# Altium schematic sheet EPS_Power.SchDoc
size A4; SheetNumber: 3; SheetTotal: 4
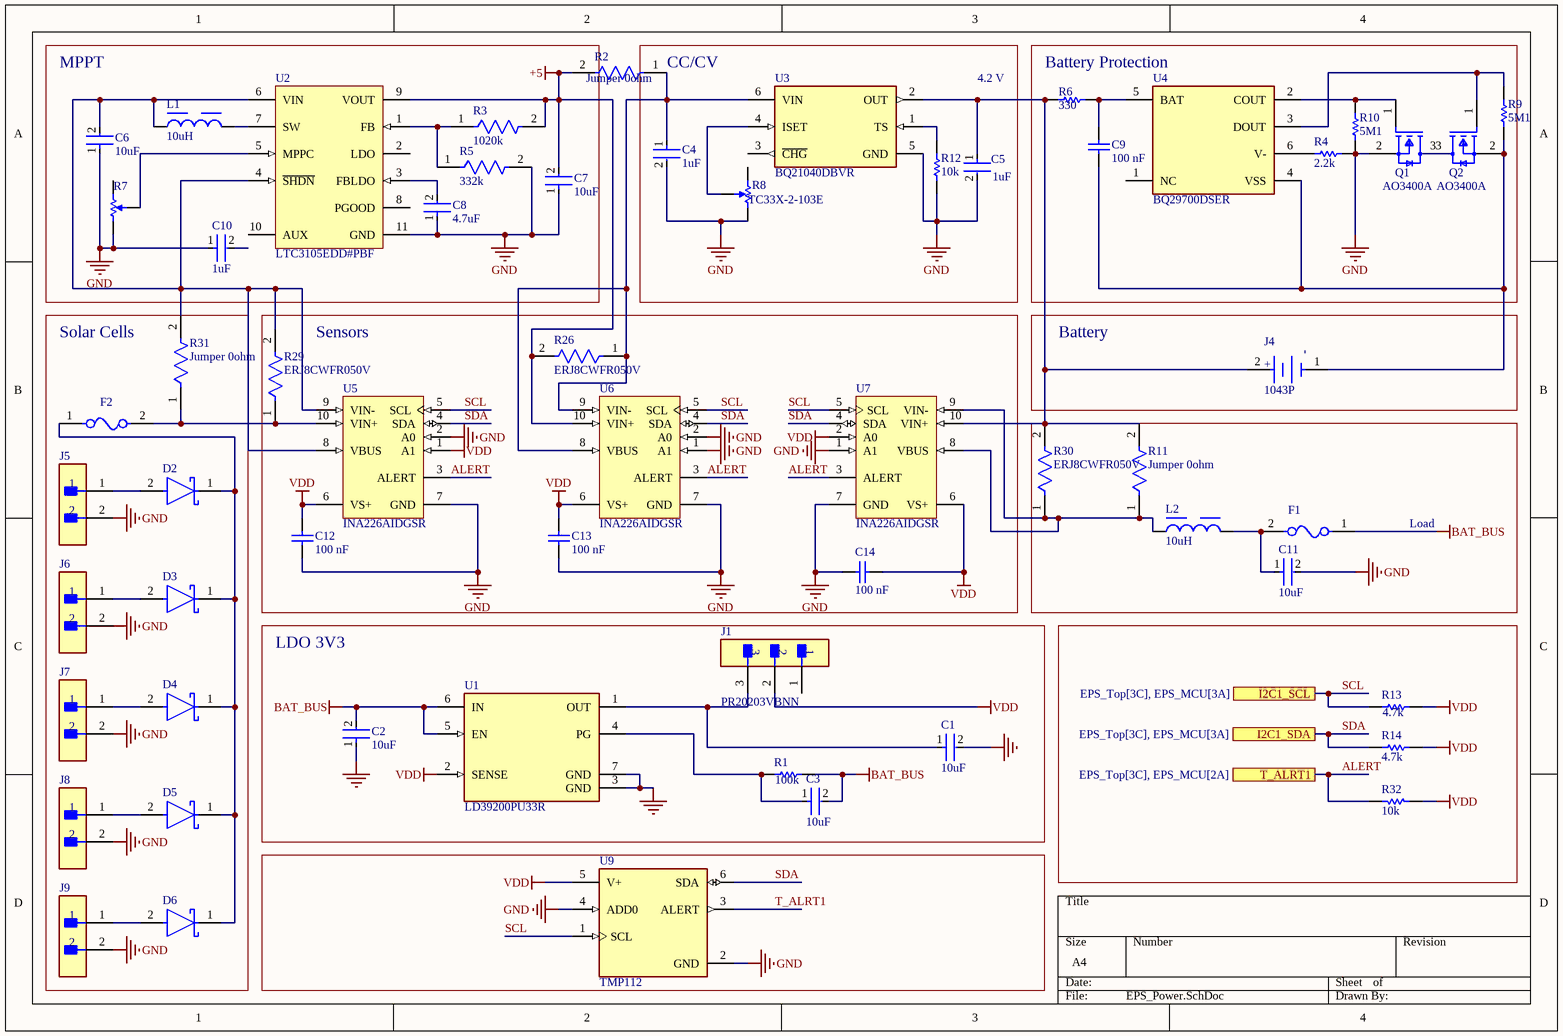
[diagram p0: EPS_Power.SchDoc]

## Parts
C1  10uF  [FP-CL21B106KOQNNNG-MFG]
C2  10uF  [FP-CL21B106KOQNNNG-MFG]
C3  10uF  [FP-CL21B106KOQNNNG-MFG]
C4  1uF  [FP-CL10-IPC_C]
C5  1uF  [FP-CL10-IPC_C]
C6  10uF  [FP-CL21B106KOQNNNG-MFG]
C7  10uF  [FP-CL21B106KOQNNNG-MFG]
C8  4.7uF  [FP-CC0805-0_85-MFG]
C9  100 nF  [CAPC1050X55X23ML05T13]
C10  1uF  [FP-CL10-IPC_A]
C11  10uF  [FP-CL21B106KOQNNNG-MFG]
C12  100 nF  [CAPC1050X55X23ML05T13]
C13  100 nF  [CAPC1050X55X23ML05T13]
C14  100 nF  [CAPC1050X55X23ML05T13]
D2  BAT60AE6327HTSA1  [FP-PG-SOD323-2-IPC_C]  (value not drawn)
D3  BAT60AE6327HTSA1  [FP-PG-SOD323-2-IPC_C]  (value not drawn)
D4  BAT60AE6327HTSA1  [FP-PG-SOD323-2-IPC_C]  (value not drawn)
D5  BAT60AE6327HTSA1  [FP-PG-SOD323-2-IPC_C]  (value not drawn)
D6  BAT60AE6327HTSA1  [FP-PG-SOD323-2-IPC_C]  (value not drawn)
F1  MF-NSMF020-2  [FP-MF-NSMF020-2-MFG]  (value not drawn)
F2  MF-NSMF020-2  [FP-MF-NSMF020-2-MFG]  (value not drawn)
J1  PR20203VBNN  [FP-PR20203VBNN-MFG]
J4  1043P  [FP-1043P-MFG]
J5  B2B-XH-A(LF)(SN)  [FP-B2B-XH-A_LF_SN-MFG]  (value not drawn)
J6  B2B-XH-A(LF)(SN)  [FP-B2B-XH-A_LF_SN-MFG]  (value not drawn)
J7  B2B-XH-A(LF)(SN)  [FP-B2B-XH-A_LF_SN-MFG]  (value not drawn)
J8  B2B-XH-A(LF)(SN)  [FP-B2B-XH-A_LF_SN-MFG]  (value not drawn)
J9  B2B-XH-A(LF)(SN)  [FP-B2B-XH-A_LF_SN-MFG]  (value not drawn)
L1  10uH  [WE-LHMI_4020]
L2  10uH  [WE-LHMI_4020]
Q1  AO3400A  [FP-SOT23-MFG]
Q2  AO3400A  [FP-SOT23-MFG]
R1  100k  [RESC1005X40X25NL05T10]
R2  Jumper 0ohm  [FP-RC1206-MFG]
R3  1020k  [FP-CRCW0603-e3-IPC_A]
R4  2.2k  [RESC1608X55X25LL10T15]
R5  332k  [FP-CRCW0603-e3-IPC_A]
R6  330  [RESC1608X55X30LL15T15]
R7  TC33X-2-103E  [BOUR-TC33X-2_V]  (value not drawn)
R8  TC33X-2-103E  [BOUR-TC33X-2_V]
R9  5M1  [RESC1609X50X30NL10T20]
R10  5M1  [RESC1609X50X30NL10T20]
R11  Jumper 0ohm  [FP-RC1206-MFG]
R12  10k  [RESC1005X40X25LL05T10]
R13  4.7k  [RESC1005X40X25LL05T05]
R14  4.7k  [RESC1005X40X25LL05T05]
R26  ERJ8CWFR050V  [FP-ERJ8CW-IPC_B]
R29  ERJ8CWFR050V  [FP-ERJ8CW-IPC_B]
R30  ERJ8CWFR050V  [FP-ERJ8CW-IPC_B]
R31  Jumper 0ohm  [FP-RC1206-MFG]
R32  10k  [RESC1005X40X25LL05T05]
U1  LD39200PU33R  [FP-DFN6-7946637-MFG]
U2  LTC3105EDD#PBF  [LT-DD-10_V]
U3  BQ21040DBVR  [FP-DBV0006A-MFG]
U4  BQ29700DSER  [FP-DSE0006A-IPC_B]
U5  INA226AIDGSR  [DGS0010A_L]
U6  INA226AIDGSR  [DGS0010A_L]
U7  INA226AIDGSR  [DGS0010A_L]
U9  TMP112  [FP-DRL0006A-MFG]

## Blocks framed on the sheet
MPPT: C6-C8 C10 L1 R3 R5 R7 U2
CC/CV: C4 C5 R8 R12 U3
Battery Protection: C9 Q1 Q2 R4 R6 R9 R10 U4
Solar Cells: D2-D6 F2 J5-J9 R31
Sensors: C12-C14 R26 R29 U5-U7
Battery: J4
Load: C11 F1 L2 R11 R30
LDO 3V3: C1-C3 J1 R1 U1

## Ports
I2C1_SCL (see EPS_Top[3C], EPS_MCU[3A]), I2C1_SDA (see EPS_Top[3C], EPS_MCU[3A]), T_ALRT1 (see EPS_Top[3C], EPS_MCU[2A])

## Nets
+5: C7.2 R2.2 R3.2 R26.2 U2.9(VOUT) U6.10(VIN+)
BAT_BUS: C2.2 C3.2 F1.1 R1.2 U1.5(EN) U1.6(IN)
GND: C1.2 C2.1 C4.2 C5.2 C6.1 C7.1 C8.1 C10.1 C11.2 C12.1 C13.1 C14.1 J5.2 J6.2 J7.2 J8.2 J9.2 Q1.2(S) R4.2 R5.2 R7.1 R8.3 R10.1 R12.2 U1.3(GND) U1.7(GND) U2.11(GND) U3.5(GND) U5.2(A0) U5.7(GND) U6.1(A1) U6.2(A0) U6.7(GND) U7.1(A1) U7.7(GND) U9.2(GND) U9.4(ADD0)
VDD: C12.2 C13.2 C14.2 J1.2 R13.2 R14.2 R32.1 U1.2(SENSE) U5.1(A1) U5.6(VS+) U6.6(VS+) U7.2(A0) U7.6(VS+) U9.5(V+)
ALERT: R32.2 U5.3(ALERT) U6.3(ALERT) U7.3(ALERT) ; port T_ALRT1
SCL: R13.1 U5.5(SCL) U6.5(SCL) U7.5(SCL) U9.1(SCL) ; port I2C1_SCL
SDA: R14.1 U5.4(SDA) U6.4(SDA) U7.4(SDA) U9.6(SDA) ; port I2C1_SDA
T_ALRT1: U9.3(ALERT)
NetC1_1: C1.1 J1.3 U1.1(OUT)
NetC3_1: C3.1 R1.1 U1.4(PG)
NetC4_1: C4.1 R2.1 R26.1 U3.6(VIN) U6.8(VBUS) U6.9(VIN-)
NetC5_1: C5.1 J4.2(A) R6.2 R11.2 R30.2 U3.2(OUT) U7.10(VIN+)
NetC6_2: C6.2 L1.1 R29.2 R31.2 U2.4(~{SHDN}) U2.6(VIN) U5.8(VBUS) U5.9(VIN-)
NetC8_2: C8.2 U2.3(FBLDO)
NetC9_1: C9.1 R6.1 U4.5(BAT)
NetC9_2: C9.2 J4.1(C) Q2.2(S) R9.1 U4.4(VSS)
NetC11_1: C11.1 F1.2 L2.2
NetD2_1: D2.1(C) D3.1(C) D4.1(C) D5.1(C) D6.1(C) F2.1
NetD2_2: D2.2(A) J5.1
NetD3_2: D3.2(A) J6.1
NetD4_2: D4.2(A) J7.1
NetD5_2: D5.2(A) J8.1
NetD6_2: D6.2(A) J9.1
NetF2_2: F2.2 R29.1 R31.1 U5.10(VIN+)
NetL1_2: L1.2 U2.7(SW)
NetL2_1: L2.1 R11.1 R30.1 U7.8(VBUS) U7.9(VIN-)
NetQ1_1: Q1.1(G) R10.2 U4.2(COUT)
NetQ1_3: Q1.3(D) Q2.3(D)
NetQ2_1: Q2.1(G) R9.2 U4.3(DOUT)
NetR3_1: R3.1 R5.1 U2.1(FB)
NetR4_1: R4.1 U4.6(V-)
NetR7_2: R7.2 U2.5(MPPC)
NetR8_2: R8.2 U3.4(ISET)
NetR12_1: R12.1 U3.1(TS)

Not connected (* = marked no-connect by the designer): C10 2; J1 1; R7 3; R8 1; U2 2(LDO) 8(PGOOD) 10(AUX); U3 3(~{CHG}); U4 1(NC)

## Notes on the sheet
- 4.2 V
- (near J1) +3V3
- (in symbol CMP-19636-000034-1) +

## Library data of the parts
C1-C3 C6 C7 C11 = CMP-13271-000015-1: CAP CER 10UF 16V X7R 0805; Manufacturer Part Number: CL21B106KOQNNNG; Manufacturer: Samsung Electro-Mechanics; Temperature Coefficient: 15%; Tolerance: 10%; Material: Ceramic; ComponentLink2URL: http://product.samsungsem.com/mlcc/CL21B106KOQNNN.do; Package: 0; Voltage Rating: 16V; Value: 10uF; Height: 1.4mm; Temperature Characteristic: X7R; Category: Cap; Lead Free: Yes; RoHS: TRUE; ComponentLink2Description: Datasheet; Octopart: https://octopart.com/cl21b106koqnnng-samsung-19995691; Device Class L1: Passive Components; Temperature Range Low: -55°C; Device Class L3: Ceramic Capacitors; Ipc Land Pattern Name: CAPC200125X125; Digikey Description: CAP CER 10UF 16V X7R 0805; Automotive: No; Capacitance: 10uF; Temperature Range High: +125°C; Device Class L2: Capacitors; Temperature: -55°C to +125°C
C4 C5 = CMP-13271-004127-1: Cap Ceramic 1uF 25V X5R ±10% Pad SMD 0603 +85°C T/R; Height: 0.8mm; Capacitance: 1uF; Depth: 0.8mm; Package Quantity: 1; Mount: Surface Mount; Contact Plating: Tin; Voltage Rating: 25V; Dielectric: X5R; Packaging: Tape and Reel; Material: Ceramic; Case Code (Metric): 1608; Length: 1.6mm; Voltage: 25V; Min Operating Temperature: -55°C; Width: 0.031inch; Tolerance: 10%; Case/Package: 0603; Radiation Hardening: No; Case Code (Imperial): 0603; Thickness: 0.035inch; Lead Free: Lead Free; Max Operating Temperature: 85°C; Voltage Rating (DC): 25V
C8 = CMP-03422-000207-1: CAP CER 4.7UF 16V X7R 0805; Manufacturer: Yageo; Manufacturer Part Number: CC0805KKX7R7BB475; Tolerance: 0.1; Material: Ceramic; Footprint Url: http://www.yageo.com/exep/pages/download/literatures/UPY-C_GEN_24.pdf; Device Class L3: Ceramic Capacitors; Temperature: -30°C to +85°C; Device Class L2: Capacitors; Automotive: No; Digikey Description: CAP CER 4.7UF 16V X7R 0805; Temperature Range High: +85°C; Lead Free: Yes; Mouser Description: Multilayer Ceramic Capacitors MLCC - SMD/SMT 4.7M pF 10% 16 Volts; Temperature Characteristic: X7R; Height: 0.95mm; Device Class L1: Passive Components; ComponentLink2Description: Datasheet; Category: Cap; Octopart: https://octopart.com/cc0805kkx7r7bb475-yageo-34429188; Temperature Range Low: -30°C; Package: CC0805-0.85; Ipc Land Pattern Name: CAPC200125X85; RoHS: TRUE; Value: 4.7 uF; Capacitance: 4.7 uF; ComponentLink2URL: http://www.yageo.com/documents/recent/UPY-GPHC_Y5V_6.3V-to-50V_8.pdf; Voltage Rating: 16 V
C9 C12-C14 = CMP-2000-05439-1: Chip Capacitor, 100 nF, +/- 10%, 16 V, -55 to 125 degC, 0402 (1005 Metric), RoHS, Tape and Reel; Manufacturer: Samsung Electro-Mechanics; Capacitance: 100000pF; Dielectric: X7R; Rated Voltage: 16V; Case Size/Dimension: 0402; Tolerance (%): ±10%; Manufacturer URL: http://www.samsungsem.com/global/index.jsp; Datasheet URL: https://datasheet.ciiva.com/29198/458718-da-01-en-vs-kondensator-0402-29198423.pdf; Datasheet Version: Nov-10
C10 = CMP-13271-001457-1: Cap Ceramic 1uF 16V X5R ±10% Pad SMD 0603 +85°C T/R; Dielectric: X5R; Height: 0.8mm; Capacitance: 1uF; Mount: Surface Mount; Thickness: 0.035inch; Width: 0.031inch; Min Operating Temperature: -55°C; Contact Plating: Tin; Case Code (Imperial): 0603; Depth: 0.8mm; Length: 1.6mm; Max Operating Temperature: 85°C; Packaging: Tape and Reel; Tolerance: 10%; Radiation Hardening: No; Case/Package: 0603; Package Quantity: 1; Voltage Rating: 16V; Case Code (Metric): 1608; Voltage: 16V; Material: Ceramic; Lead Free: Lead Free; Voltage Rating (DC): 16V
D2-D6 = CMP-32890-000004-1: DIODE SCHOTTKY 10V 3A SOD323-2; Forward Voltage: 370mV; Polarity: Standard; Peak Non-Repetitive Surge Current: 5A; Element Configuration: Single; Max Operating Temperature: 85°C; Current Rating: 3A; Number of Pins: 2; Mount: Surface Mount; Forward Current: 3A; Max Reverse Voltage (DC): 10V; Output Current: 3A; Contact Plating: Tin; Average Rectified Current: 3A; Lead Free: Lead Free; Max Repetitive Reverse Voltage (Vrrm): 10V; Voltage Rating (DC): 10V; Radiation Hardening: No; Halogen Free: Not Halogen Free; Case/Package: SOD-323-2; REACH SVHC: No SVHC; Min Operating Temperature: -55°C; Packaging: Tape and Reel
F1 F2 = CMP-07400-000029-1: PTC RESET FUSE 24V 200MA 1206; Manufacturer: Bourns; Trip Current: 0.46A; Trip Time: 0.6s; Hold Current: 0.2A; Current Rating: 10A; Resistance: 0.6-2.6Ω; Automotive Grade: Grade 3; Value: 0.6-2.6Ω; Voltage Rating: 24V; Ambient Temperature Range Low: -40°C; Device Class L1: Circuit Protection; Temperature Range Low: -40°C; Temperature: -40°C to +85°C; Category: Fuse; Temperature Range High: +85°C; Mouser Description: Resettable Fuses - PPTC 0.20A 24V 0.60ohm MAX (R); Device Class L3: unset; RoHS: TRUE; Package: MF-NSMF020-2; Ambient Temperature Range High: +85°C; ComponentLink2Description: Datasheet; Digikey Description: PTC RESET FUSE 24V 200MA 1206; Device Class L2: PTC Resettable Fuses; Manufacturer Part Number: MF-NSMF020-2; Octopart: https://octopart.com/mf-nsmf020-2-bourns-94649; Automotive: Yes; Height: 0.85mm; Lead Free: Yes; ComponentLink2URL: https://www.bourns.com/docs/Product-Datasheets/mfnsmf.pdf
J1 = CMP-77940-000002-1: CONN HEADER VERT 3POS 2.54MM; Manufacturer: Metz Connect; Conn Orientation: Straight; Current Rating: 3A; Number Of Contacts: 3; Conn Gender: Male; Temperature: -40°C to +105°C; Pitch: 2.54mm; Device Class L1: Connectors; Digikey Description: CONN HEADER VERT 3POS 2.54MM; ComponentLink2URL: https://datasheet.octopart.com/PR20203VBNN-Metz-Connect-datasheet-101610322.pdf; Height: 8.6mm; Temperature Range High: +105°C; Manufacturer Part Number: PR20203VBNN; Number Of Rows: 1; Octopart: https://octopart.com/pr20203vbnn-metz+connect-87667116; Device Class L3: unset; ComponentLink2Description: Datasheet; Device Class L2: Headers and Wire Housings; Temperature Range Low: -40°C; Automotive: No; Contact Material: Gold,Nickel; Category: Conn; Lead Free: Yes; RoHS: TRUE; Package: PR20203VBNN
J4 = CMP-19636-000034-1: BATT HOLDER 18650 1 CELL PC PIN; Number of Cells: 1; Series: -; Termination: PC Pin; Package Quantity: 50; Min Operating Temperature: -50°C; Mount: Through Hole; Packaging: Tray; Max Operating Temperature: 145°C
J5-J9 = CMP-2000-05888-3: CONN HEADER VERT 2POS 2.5MM; Current Rating: 3A; Voltage Rating: 250V; Number of Contacts: 2; Contact Resistance: 20mR; Wire/Cable Gauge: 22AWG; Insulation Resistance: 1GR; Connector Type: Male Pin; Packaging: Bulk; Contact Material: Brass; Lead Free: Lead Free; Orientation: Straight; Contact Plating: Tin; Max Current Rating: 3A; Termination: Solder; Fastening Type: Detent; Depth: 5.75mm; Housing Material: Polyamide; REACH SVHC: No SVHC; Series: XH; Voltage Rating (AC): 250V; Number of Positions: 2; Color: Natural; Contact Type: Male Pin; Max Voltage Rating (DC): 250V; Pitch: 2.5mm; Lead Pitch: 2.5mm; Mount: Through Hole; Max Operating Temperature: 85°C; Length: 7.4mm; Max Voltage Rating (AC): 250V; Min Operating Temperature: -25°C; Number of Rows: 1; Housing Color: White
L1 L2 = CMP-1353-00043-5: NexarPartId: 21272410; Inductance: 10µH; Tolerance: 20%; Max DC Current: 1.5A; Shielding: Shielded; Frequency: 23MHz; DC Resistance (DCR): 215mΩ; Test Frequency: 100kHz; Core Material: Composite, Ferrite; Series Resistance: 243mΩ; REACH SVHC: Unknown; Case/Package: Nonstandard; Width: 4.06mm; Packaging: Tape & Reel (TR); Height - Seated (Max): 2.0066mm; Ambient Temperature Range Low: -40°C; Length: 4.45mm; Mount: Surface Mount; Ambient Temperature Range High: 85°C; Inductance Tolerance: 20%; Composition: Wirewound; Min Operating Temperature: -40°C; Current Rating: 1.5A; Max Operating Temperature: 125°C; Depth: 4.06mm; Height: 1.8mm; Saturation Current: 1.5A; RMS Current (Irms): 1.5A; Termination: SMD/SMT; Number of Pins: 2; RoHS: Compliant; Self Resonant Frequency: 23MHz
Q1 Q2 = CMP-83955-000006-1: MOSFET N-CH 30V 5.7A SOT23; Input Capacitance: 630pF; Number of Elements: 1; Rds On Max: 26.5mR; Max Power Dissipation: 1.4W; Gate to Source Voltage (Vgs): 12V; Min Operating Temperature: -55°C; Lead Free: Lead Free; Number of Pins: 3; Drain to Source Voltage (Vdss): 30V; Case/Package: SOT-23; Mount: Surface Mount; Continuous Drain Current (ID): 5.7A; Radiation Hardening: No; Packaging: Tape and Reel; Max Operating Temperature: 150°C; Power Dissipation: 1.4W
R1 = CMP-2002-07343-1: Part Number: RC0402FR-07100KL; Manufacturer: Yageo / Phycomp
R2 R11 R31 = CMP-2100-03681-2: RES SMD 0 OHM JUMPER 1/4W 1206; Manufacturer Part Number: RC1206JR-070RL; Manufacturer: YAGEO; Voltage Rating: 200V; Temperature Coefficient: 300ppm/°C; Power Rating: 0.25W; Value: 0Ω; Tolerance: 5%; Temperature Range Low: -55°C; Category: Res; Automotive: No; Ipc Land Pattern Name: RESC310160X55; Device Class L1: Passive Components; Temperature: -55°C to +155°C; ComponentLink2URL: https://www.yageo.com/upload/media/product/productsearch/datasheet/rchip/PYu-RC_Group_51_RoHS_L_10.pdf; Lead Free: Yes; Height: 0.65mm; Footprint Url: https://www.yageo.com/upload/website/yageo_PYu-R_Mount_10_19050818_343.pdf; Package: RC1206; Digikey Description: RES SMD 0 OHM JUMPER 1/4W 1206; Temperature Range High: +155°C; Device Class L3: Chip SMD Resistors; Device Class L2: Resistors; Octopart: https://octopart.com/rc1206jr-070rl-yageo-40025601; Resistance: 0Ω; Series: RC; ComponentLink2Description: Datasheet; Composition: Thick Film; RoHS: TRUE; Mouser Description: Resistor: thick film; SMD; 1206; 0O; 0.25W; ±5%; -55÷155°C
R3 = CMP-2000-03018-2: RES Thick Film, 1.02MΩ, 1%, 0.1W, 100ppm/°C, 0603; Voltage Rating (DC): 75V; Power Rating: 100mW; Resistance: 1.02MR; Features: Automotive AEC-Q200; Depth: 0.85mm; Max Operating Temperature: 155°C; Tolerance: 1%; Package Quantity: 10; Length: 1.55mm; Mount: Surface Mount; Termination: SMD/SMT; Width: 0.033inch; Temperature Coefficient: 100ppm/°C; Min Operating Temperature: -55°C; Composition: Thick Film; Max Power Dissipation: 100mW; Case Code (Imperial): 0603; Case/Package: 0603; Voltage Rating: 75V; Contact Plating: Tin; Case Code (Metric): 1608; Weight: 7.1E-05oz; Lead Free: Lead Free; Height: 0.02inch; Military Standard: Not; Number of Terminations: 2; Radiation Hardening: No; Packaging: Tape and Reel
R4 = CMP-2000-06934-1: Thick Film Resistor, 2.2 KOhm, 100 mW, 50 V, +/- 1%, -55 to 155 degC, 2-Pin SMD (0603), RoHS, Tape and Reel; Manufacturer: Yageo; Resistance: 2.2kOhms; Temperature Coefficient: 100PPM/C; Voltage Rating: 50V; Power Rating: 100mW; Tolerance: 1%; Datasheet Version: Rev. 7, 05/2017; Case Code - mm: 1608; Series: RC; Mounting Technology: SurfaceMount; Package Description: 2-Pin Surface Mount Device, Body 1.6 x 0.8 mm; Case Code - in: 0603; Package Reference: 0603; Product: ThickFilmResistorsGeneralPurpose; Manufacturer URL: http://www.yageo.com/; Termination Style: SMD/SMT; Operating Temperature Range: -55Cto+155C; Datasheet URL: http://www.yageo.com/documents/recent/PYu-RC_Group_51_RoHS_L_7.pdf; Packaging: Reel
R5 = CMP-2000-03242-2: RES Thick Film, 332kΩ, 1%, 0.1W, 100ppm/°C, 0603; Voltage Rating: 75V; Resistance: 332kR; Max Power Dissipation: 100mW; Radiation Hardening: No; Max Operating Temperature: 155°C; Termination: SMD/SMT; Case Code (Imperial): 0603; Case/Package: 0603; Contact Plating: Tin; Case Code (Metric): 1608; Features: Automotive AEC-Q200; Number of Terminations: 2; Number of Pins: 2; Package Quantity: 10; Min Operating Temperature: -55°C; Temperature Coefficient: 100ppm/°C; Length: 1.55mm; Working Voltage: 75V; Packaging: Tape and Reel; Weight: 7.1E-05oz; Width: 0.85mm; Height: 0.45mm; Depth: 0.85mm; Tolerance: 1%; Power Rating: 100mW; Military Standard: Not; Composition: Thick Film; Lead Free: Lead Free; Voltage Rating (DC): 75V
R6 = CMP-2000-00435-2: Chip Resistor, 330 Ohm, +/- 1%, 0.1 W, -55 to 155 degC, 0603 (1608 Metric), RoHS, Tape and Reel; Gender: Male; Mating Cycles: 10000; Current Rating: 500 mA; Voltage Rating: 10 V; REACH SVHC: No SVHC; PackageDescription: 2-Pin Surface Mount Device, Body 1.6 x 0.85 mm; Contact Finish: Gold; Pins: 8; ComponentLink1Description: Manufacturer URL; Packaging: Tape and Reel; Max Operating Temperature: 85 degC; Contact Material: Copper; Height: 1.45 mm; Width: 1.45 mm; DatasheetVersion: Apr-15; Package Quantity: 1500; Contact Plating: Gold; PackageReference: 0603; Mount: Surface Mount; Lead Pitch: 1.1 mm; Min Operating Temperature: -25 degC; ComponentLink1URL: http://www.panasonic.com/; ComponentLink2URL: http://industrial.panasonic.com/cdbs/www-data/pdf/RDA0000/AOA0000C86.pdf; Length: 13.7 mm; ComponentLink2Description: Datasheet; RoHSCompliant: true
R7 R8 = CMP-2100-03695-1: Trimming Potentiometer, 10000 Ohm, -40 to 100 degC, 3-Pin SMD, RoHS, Tape and Reel; Manufacturer: Bourns; Tolerance: 25%; Max Power Dissipation: 100mW; Number of Turns: 1; Resistance: 10KOhm; Temperature Coefficient: 250ppm/degreesC; Voltage Rating (DC): 50V; Datasheet URL: http://www.bourns.com/docs/Product-Datasheets/TC33.pdf; Composition: Potentiometer; Package Description: 3-Pin Surface Mount Device, Body 3.8 x 3.6 mm; Weight: 29.4mg; Power Rating: 100mW; Termination: FootPrint; Manufacturer URL: http://www.bourns.com/; Width: 0.118inch; Height: 0.047inch; Military Standard: Not; Radiation Hardening: No; Colour: Silver; Case/Package: SMD/SMT; Depth: 3.8mm; Min Operating Temperature: -40degC; Lead Free: LeadFree; Datasheet Version: 42583.0; REACH SVHC: NoSVHC; Length: 3mm; RoHSCompliant: true; Contact Plating: Silver; Taper: Linear; Packaging: TapeandReel; Mount: SurfaceMount; Max Operating Temperature: 100degC; Package Reference: TC33X-2; Package Quantity: 2500
R9 R10 = CMP-2000-03491-1: Part Number: CRCW06035M10FKEA; Manufacturer: Vishay Dale
R12 = CMP-2002-07353-1: Part Number: RC0402FR-0710KL; Manufacturer: Yageo / Phycomp
R13 R14 = CMP-2002-01154-4: Chip Resistor, 4.7 KOhm, +/- 1%, 0.1 W, -55 to 155 degC, 0402 (1005 Metric), RoHS, Tape and Reel; PartNumber: ERJ-2RKF4701X; Voltage Rating: 50 V; Case\/Package: 0402; Power Rating: 100 mW; Height: 0.35 mm; Mounting Technology: Surface Mount; REACH SVHC: Yes; Resistance: 4.7 KOhm; Max Operating Temperature: 155 degC; ComponentLink1Description: Manufacturer URL; ComponentLink2Description: Datasheet; Pins: 2; PackageReference: 0402; Tolerance: 1%; Case Code (Imperial): 0402; Length: 1 mm; PackageDescription: 2-Pin Surface Mount Device, Body 1 x 0.5 mm; RoHSCompliant: true; Package Quantity: 1; Radiation Hardening: No; DatasheetVersion: 04/2015; Width: 0.5 mm; Case Code (Metric): 1005; Mount: Surface Mount; ComponentLink1URL: http://www.panasonic.com/; Min Operating Temperature: -55 degC; Packaging: Cut Tape; ComponentLink2URL: http://industrial.panasonic.com/cdbs/www-data/pdf/RDA0000/AOA0000C86.pdf
R26 R29 R30 = CMP-2003-00803-2: RES 0.05 OHM 1% 1W 1206; Temperature Coefficient: 75ppm/°C; Resistance: 50mR; Power Rating: 1W; Case Code (Metric): 3216; Features: Automotive AEC-Q200; Height: 0.03inch; RoHS Compliant: Yes; Mount: Surface Mount; Max Power Dissipation: 1W; Max Operating Temperature: 125°C; REACH SVHC: No SVHC; Number of Terminations: 2; Case Code (Imperial): 1206; Termination: SMD/SMT; Case/Package: 1206; Packaging: Cut Tape; Resistor Type: Thick Film; Width: 0.063inch; Depth: 1.6mm; Length: 0.126inch; Tolerance: 1%; Min Operating Temperature: -55°C
R32 = CMP-2000-07588-1: Chip Resistor, 10 KOhm, +/- 1%, 0.1 W, -55 to 155 degC, 0402 (1005 Metric), RoHS, Tape and Reel; Manufacturer: Panasonic; Power Rating: 100mW; Voltage Rating: 50V; Resistance: 10KOhm; Case\/Package: 0402; Temperature Coefficient: 100ppm\/degreesC; RoHSCompliant: True; Lead Free: LeadFree; Package Quantity: 1; Contact Plating: Tin; Length: 1mm; Radiation Hardening: No; REACH SVHC: NoSVHC; Max Operating Temperature: 155degC; Depth: 0.5mm; Case Code (Imperial): 0402; Military Standard: Not; Package Description: 2-Pin Surface Mount Device, Body 1 x 0.5 mm; Termination: SMD/SMT; Case Code (Metric): 1005; Height: 0.35mm; Packaging: TapeandReel; Voltage Rating (DC): 50V; Package Reference: 402; Number of Pins: 2; Tolerance: 1%; Mounting Technology: SurfaceMount; Width: 0.02inch; Mount: SurfaceMount; Datasheet URL: https://industrial.panasonic.com/cdbs/www-data/pdf/RDA0000/AOA0000C304.pdf; Composition: ThickFilm; Datasheet Version: 02/2017; Manufacturer URL: http://www.panasonic.com/; Max Power Dissipation: 100mW; Number of Terminations: 2; Min Operating Temperature: -55degC
U1 = CMP-12153-000011-1: IC REG LINEAR 3.3V 2A 6DFN; Number of Outputs: 1; Max Input Voltage: 6V; Output Type: Fixed; Min Input Voltage: 1.25V; Dropout Voltage: 130mV; Operating Supply Current: 1mA; Number of Regulators: 1; Case/Package: DFN; Packaging: Tape and Reel; Output Current: 2A; Min Operating Temperature: -40°C; Mount: Surface Mount; Output Voltage: 3.3V; Max Operating Temperature: 125°C; Lead Free: Lead Free; Package Quantity: 3000
U2 = CMP-0473-00051-1: 400 mA Step-Up DC/DC Converter with Maximum Power Point Control and 250 mV Start-Up, 10-pin SON (DD-10), -40 to 85 degC, Pb-Free; Manufacturer: Linear Technology; Vin Min(V): 0.225; Vin Max(V): 5; Energy Source: Solar; Number of Outputs: 1; Topology: Boost; Vout Max(V): 5.25; ComponentLink2Description: Datasheet; ComponentLink3Description: Package Specification; Mounting Technology: Surface Mount; ComponentLink1URL: http://www.linear.com/; PackageVersion: Rev. C, 06/2010; RoHS: TRUE; ComponentLink1Description: Manufacturer URL; PackageReference: DD-10; ComponentLink2URL: http://cds.linear.com/docs/en/datasheet/3105fa.pdf; PartNumber: LTC3105EDD#PBF; PackageDescription: 10-Pin Plastic DFN, Body 3 x 3 mm, Pitch 0.5 mm; ComponentLink3URL: http://cds.linear.com/docs/en/packaging/DFN_10_05-08-1699.pdf; DatasheetVersion: Rev. A; Code_JEDEC: MO-229
U3 = CMP-04911-000045-1: IC BATT CHG LI-ION 1CELL SOT23-6; Differential Output: No; Settling Time: 30us; Fault Protection: Over Voltage; Number of Bits: 16; Output Type: Analog Current/Voltage; Interface: USB; Number of Cells: 1; Max Supply Voltage: 6.45V; Battery Pack Voltage: 4.2V; Max Charge Current: 800mA; Number of D/A Converters: 4; Mount: Surface Mount; Case/Package: SOT-23-6; RoHS Compliant: Yes; Packaging: Cut Tape; Min Operating Temperature: 0°C; Lead Free: Lead Free; Max Operating Temperature: 125°C
U4 = CMP-04911-000043-1: IC LITHIUM BATT PROTECT 6-SON; Number of Cells: 1; Fault Protection: Over Current; Operating Supply Voltage: 8V; Packaging: Tape and Reel; RoHS Compliant: Yes; Contact Plating: Gold; Lead Free: Lead Free; Min Operating Temperature: -40°C; Number of Pins: 6; Max Operating Temperature: 85°C; Package Quantity: 3000; Mount: Surface Mount; Weight: 0.000342oz; Supplier: Future Electronics; Supplier Part Number: 4023214
U5-U7 = CMP-0704-00058-2: High-Side Measurement, Bi-Directional Current / Power Monitor with I2C Interface, 2.7 to 5.5 V, -40 to 125 degC, 10-pin SOP (DGS10), Green (RoHS & no Sb/Br); Vs(Max)(V): 5.5; CMRR(Min)(dB): 126; Rating: Catalog; Input Offset (+/-)(Max)(uV): 10; Small-Signal Bandwidth(Typ)(MHz): 0.007; Input Offset Drift (+/-)(Max)(uV/Degrees Celsius): 0.1; Common Mode Range(Max)(V): 36; Gain(V/V): 1; SubFamily: Current Shunt Monitor; Quiescent Current (+/-)(Typ)(mA): 0.33; Vs(Min)(V): 2.7; Common Mode Range(Min)(V): 0; ComponentLink2URL: http://www.ti.com/general/docs/lit/getliterature.tsp?genericPartNumber=INA226&fileType=pdf; ComponentLink1URL: http://www.ti.com/; PartNumber: INA226AIDGSR; Mounting Technology: Surface Mount; PackageDescription: 10-Pin Plastic Small Outline, Body 3 x 3 mm, Pitch 0.5 mm; ComponentLink3Description: Package Specification; Code_JEDEC: MO-153; Eco-Plan: Green (RoHS & no Sb/Br); PackageReference: DGS0010A; ComponentLink2Description: Datasheet; ComponentLink3URL: http://www.ti.com/lit/ml/mpds035b/mpds035b.pdf; ComponentLink1Description: Manufacturer URL; DatasheetVersion: SBOS547; PackageVersion: 4073272/C, 02/2004
U9 = CMP-04948-000024-1: SENSOR DIGITAL -40C-125C 6SOT / TMP112AIDRLR, NOT AQDRLRQ1; Manufacturer: Texas Instruments; Manufacturer Part Number: TMP112AQDRLRQ1; Resolution: 12bits; Automotive Grade: Grade 1; Standoff Height: 0mm; Max Junction Temp: +150°C; Max Supply Voltage: 3.6V; Min Supply Voltage: 1.4V; Output Voltage: 5V; Interface: I2C,2-Wire,SMBus; Sensor Output: I2C,SMBus; Operating Supply Current: 7-85uA; Temperature Range Low: -40°C; Device Class L2: Temperature and Humidity Sensors; Height: 0.6mm; Automotive: Yes; Temperature Range High: +125°C; Category: IC; RoHS: TRUE; Lead Free: Yes; Ambient Temperature Range High: +125°C; Ambient Temperature Range Low: -40°C; Octopart: https://octopart.com/tmp112aqdrlrq1-texas+instruments-50418097; Ipc Land Pattern Name: SOTFL50P160X60-6; Device Class L1: Sensors; Device Class L3: unset; Digikey Description: SENSOR DIGITAL -40C-125C 6SOT; Mouser Description: Temp Sensor Digital Serial (2-Wire, I2C) Automotive 6-Pin SOT-563 T/R; Temperature: -40°C to +125°C; ComponentLink2Description: Datasheet; ComponentLink2URL: http://www.ti.com/lit/ds/symlink/tmp112-q1.pdf; Package: DRL0006A